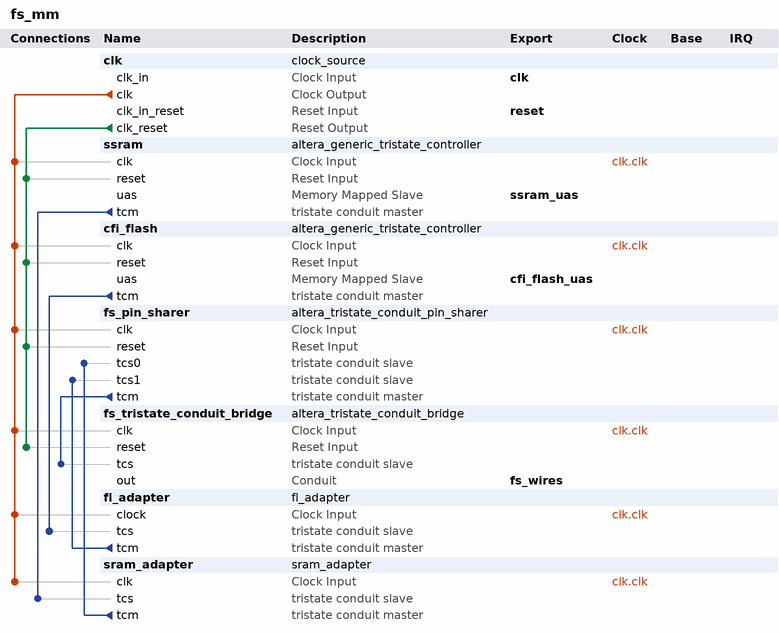
[diagram p0: system contents]
# Platform Designer (Qsys) system fs_mm, Cyclone IV GX EP4CGX150DF31C7
# Parameters at their usual value, and those the tool derives, are not listed.
package require -exact qsys 15.0
create_system fs_mm
set_project_property DEVICE_FAMILY {Cyclone IV GX}
set_project_property DEVICE EP4CGX150DF31C7

add_instance clk clock_source 15.0
set_instance_parameter_value clk clockFrequency 50000000

add_instance ssram altera_generic_tristate_controller 15.0
set_instance_parameter_value ssram ACTIVE_LOW_BEGINTRANSFER 1
set_instance_parameter_value ssram ACTIVE_LOW_BYTEENABLE 1
set_instance_parameter_value ssram ACTIVE_LOW_OUTPUTENABLE 1
set_instance_parameter_value ssram ACTIVE_LOW_READ 0
set_instance_parameter_value ssram ACTIVE_LOW_RESET_OUTPUT 1
set_instance_parameter_value ssram CHIPSELECT_THROUGH_READLATENCY 1
set_instance_parameter_value ssram INTERFACE_ASSIGNMENT_KEYS embeddedsw.configuration.isMemoryDevice
set_instance_parameter_value ssram INTERFACE_ASSIGNMENT_VALUES 1
set_instance_parameter_value ssram MODULE_ASSIGNMENT_KEYS embeddedsw.configuration.hwClassnameDriverSupportList,embeddedsw.CMacro.SRAM_MEMORY_SIZE,embeddedsw.CMacro.SRAM_MEMORY_UNITS,embeddedsw.CMacro.SSRAM_DATA_WIDTH,embeddedsw.CMacro.SSRAM_READ_LATENCY,embeddedsw.memoryInfo.MEM_INIT_DATA_WIDTH,embeddedsw.memoryInfo.HAS_BYTE_LANE,embeddedsw.memoryInfo.GENERATE_DAT_SYM,embeddedsw.memoryInfo.DAT_SYM_INSTALL_DIR
set_instance_parameter_value ssram MODULE_ASSIGNMENT_VALUES altera_avalon_lan91c111:altera_avalon_cfi_flash,2,524288,32,2,32,1,1,SIM_DIR
set_instance_parameter_value ssram TCM_ADDRESS_W 20
set_instance_parameter_value ssram TCM_BYTEENABLE_W 4
set_instance_parameter_value ssram TCM_DATA_HOLD 0
set_instance_parameter_value ssram TCM_DATA_W 32
set_instance_parameter_value ssram TCM_MAX_PENDING_READ_TRANSACTIONS 5
set_instance_parameter_value ssram TCM_READLATENCY 4
set_instance_parameter_value ssram TCM_READ_WAIT 0
set_instance_parameter_value ssram TCM_SETUP_WAIT 0
set_instance_parameter_value ssram TCM_SYMBOLS_PER_WORD 4
set_instance_parameter_value ssram TCM_TIMING_UNITS 1
set_instance_parameter_value ssram TCM_TURNAROUND_TIME 2
set_instance_parameter_value ssram TCM_WRITE_WAIT 0
set_instance_parameter_value ssram USE_BEGINTRANSFER 1
set_instance_parameter_value ssram USE_BYTEENABLE 1
set_instance_parameter_value ssram USE_OUTPUTENABLE 1
set_instance_parameter_value ssram USE_READ 0
set_instance_parameter_value ssram USE_RESET_OUTPUT 1

add_instance cfi_flash altera_generic_tristate_controller 15.0
set_instance_parameter_value cfi_flash ACTIVE_LOW_BEGINTRANSFER 0
set_instance_parameter_value cfi_flash ACTIVE_LOW_BYTEENABLE 0
set_instance_parameter_value cfi_flash ACTIVE_LOW_OUTPUTENABLE 1
set_instance_parameter_value cfi_flash ACTIVE_LOW_READ 0
set_instance_parameter_value cfi_flash CHIPSELECT_THROUGH_READLATENCY 0
set_instance_parameter_value cfi_flash INTERFACE_ASSIGNMENT_KEYS embeddedsw.configuration.isFlash,embeddedsw.configuration.isMemoryDevice,embeddedsw.configuration.isNonVolatileStorage
set_instance_parameter_value cfi_flash INTERFACE_ASSIGNMENT_VALUES 1,1,1
set_instance_parameter_value cfi_flash MODULE_ASSIGNMENT_KEYS embeddedsw.configuration.hwClassnameDriverSupportList,embeddedsw.configuration.hwClassnameDriverSupportDefault,embeddedsw.CMacro.SETUP_VALUE,embeddedsw.CMacro.WAIT_VALUE,embeddedsw.CMacro.HOLD_VALUE,embeddedsw.CMacro.TIMING_UNITS,embeddedsw.CMacro.SIZE,embeddedsw.memoryInfo.MEM_INIT_DATA_WIDTH,embeddedsw.memoryInfo.HAS_BYTE_LANE,embeddedsw.memoryInfo.IS_FLASH,embeddedsw.memoryInfo.GENERATE_DAT_SYM,embeddedsw.memoryInfo.GENERATE_FLASH,embeddedsw.memoryInfo.DAT_SYM_INSTALL_DIR,embeddedsw.memoryInfo.FLASH_INSTALL_DIR
set_instance_parameter_value cfi_flash MODULE_ASSIGNMENT_VALUES altera_avalon_lan91c111:altera_avalon_cfi_flash,altera_avalon_cfi_flash,60,160,60,ns,67108864u,16,1,1,1,1,SIM_DIR,APP_DIR
set_instance_parameter_value cfi_flash TCM_ADDRESS_W 26
set_instance_parameter_value cfi_flash TCM_BYTEENABLE_W 2
set_instance_parameter_value cfi_flash TCM_DATA_HOLD 60
set_instance_parameter_value cfi_flash TCM_DATA_W 16
set_instance_parameter_value cfi_flash TCM_MAX_PENDING_READ_TRANSACTIONS 3
set_instance_parameter_value cfi_flash TCM_READLATENCY 2
set_instance_parameter_value cfi_flash TCM_READ_WAIT 160
set_instance_parameter_value cfi_flash TCM_SETUP_WAIT 60
set_instance_parameter_value cfi_flash TCM_SYMBOLS_PER_WORD 2
set_instance_parameter_value cfi_flash TCM_TIMING_UNITS 0
set_instance_parameter_value cfi_flash TCM_TURNAROUND_TIME 2
set_instance_parameter_value cfi_flash TCM_WRITE_WAIT 160
set_instance_parameter_value cfi_flash USE_BEGINTRANSFER 0
set_instance_parameter_value cfi_flash USE_BYTEENABLE 0
set_instance_parameter_value cfi_flash USE_OUTPUTENABLE 1
set_instance_parameter_value cfi_flash USE_READ 0

add_instance fs_pin_sharer altera_tristate_conduit_pin_sharer 15.0
set_instance_parameter_value fs_pin_sharer MODULE_ORIGIN_LIST fl_adapter.tcm,fl_adapter.tcm,fl_adapter.tcm,fl_adapter.tcm,fl_adapter.tcm,sram_adapter.tcm,sram_adapter.tcm,sram_adapter.tcm,sram_adapter.tcm,sram_adapter.tcm,sram_adapter.tcm,sram_adapter.tcm,sram_adapter.tcm
set_instance_parameter_value fs_pin_sharer NUM_INTERFACES 2
set_instance_parameter_value fs_pin_sharer SHARED_SIGNAL_LIST fs_addr,fl_oe_n,fl_we_n,fs_data,fl_ce_n,sram_ce_n,sram_be_n,sram_oe_n,sram_we_n,fs_data,fs_addr,sram_reset_n,sram_begintransfer_n
set_instance_parameter_value fs_pin_sharer SIGNAL_ORIGIN_LIST address,outputenable_n,write_n,data,chipselect_n,chipselect_n,byteenable_n,outputenable_n,write_n,data,address,reset_n,begintransfer_n

add_instance fs_tristate_conduit_bridge altera_tristate_conduit_bridge 15.0

add_instance fl_adapter fl_adapter 1.0

add_instance sram_adapter sram_adapter 1.0

# connections
add_connection clk.clk cfi_flash.clk clock
add_connection clk.clk fl_adapter.clock clock
add_connection clk.clk fs_pin_sharer.clk clock
add_connection clk.clk fs_tristate_conduit_bridge.clk clock
add_connection clk.clk sram_adapter.clk clock
add_connection clk.clk ssram.clk clock
add_connection clk.clk_reset cfi_flash.reset reset
add_connection clk.clk_reset fs_pin_sharer.reset reset
add_connection clk.clk_reset fs_tristate_conduit_bridge.reset reset
add_connection clk.clk_reset ssram.reset reset
add_connection cfi_flash.tcm fl_adapter.tcs tristate_conduit
add_connection fl_adapter.tcm fs_pin_sharer.tcs1 tristate_conduit
add_connection fs_pin_sharer.tcm fs_tristate_conduit_bridge.tcs tristate_conduit
add_connection sram_adapter.tcm fs_pin_sharer.tcs0 tristate_conduit
add_connection ssram.tcm sram_adapter.tcs tristate_conduit

# exported interfaces
add_interface cfi_flash_uas avalon slave
set_interface_property cfi_flash_uas EXPORT_OF cfi_flash.uas
add_interface clk clock sink
set_interface_property clk EXPORT_OF clk.clk_in
add_interface fs_wires conduit end
set_interface_property fs_wires EXPORT_OF fs_tristate_conduit_bridge.out
add_interface reset reset sink
set_interface_property reset EXPORT_OF clk.clk_in_reset
add_interface ssram_uas avalon slave
set_interface_property ssram_uas EXPORT_OF ssram.uas

set_interconnect_requirement {$system} qsys_mm.clockCrossingAdapter HANDSHAKE
set_interconnect_requirement {$system} qsys_mm.enableEccProtection FALSE
set_interconnect_requirement {$system} qsys_mm.insertDefaultSlave FALSE
set_interconnect_requirement {$system} qsys_mm.maxAdditionalLatency 1

save_system fs_mm.qsys
